# Altium schematic sheet DriverIC.SchDoc
size A4; SheetNumber: 2; SheetTotal: 4
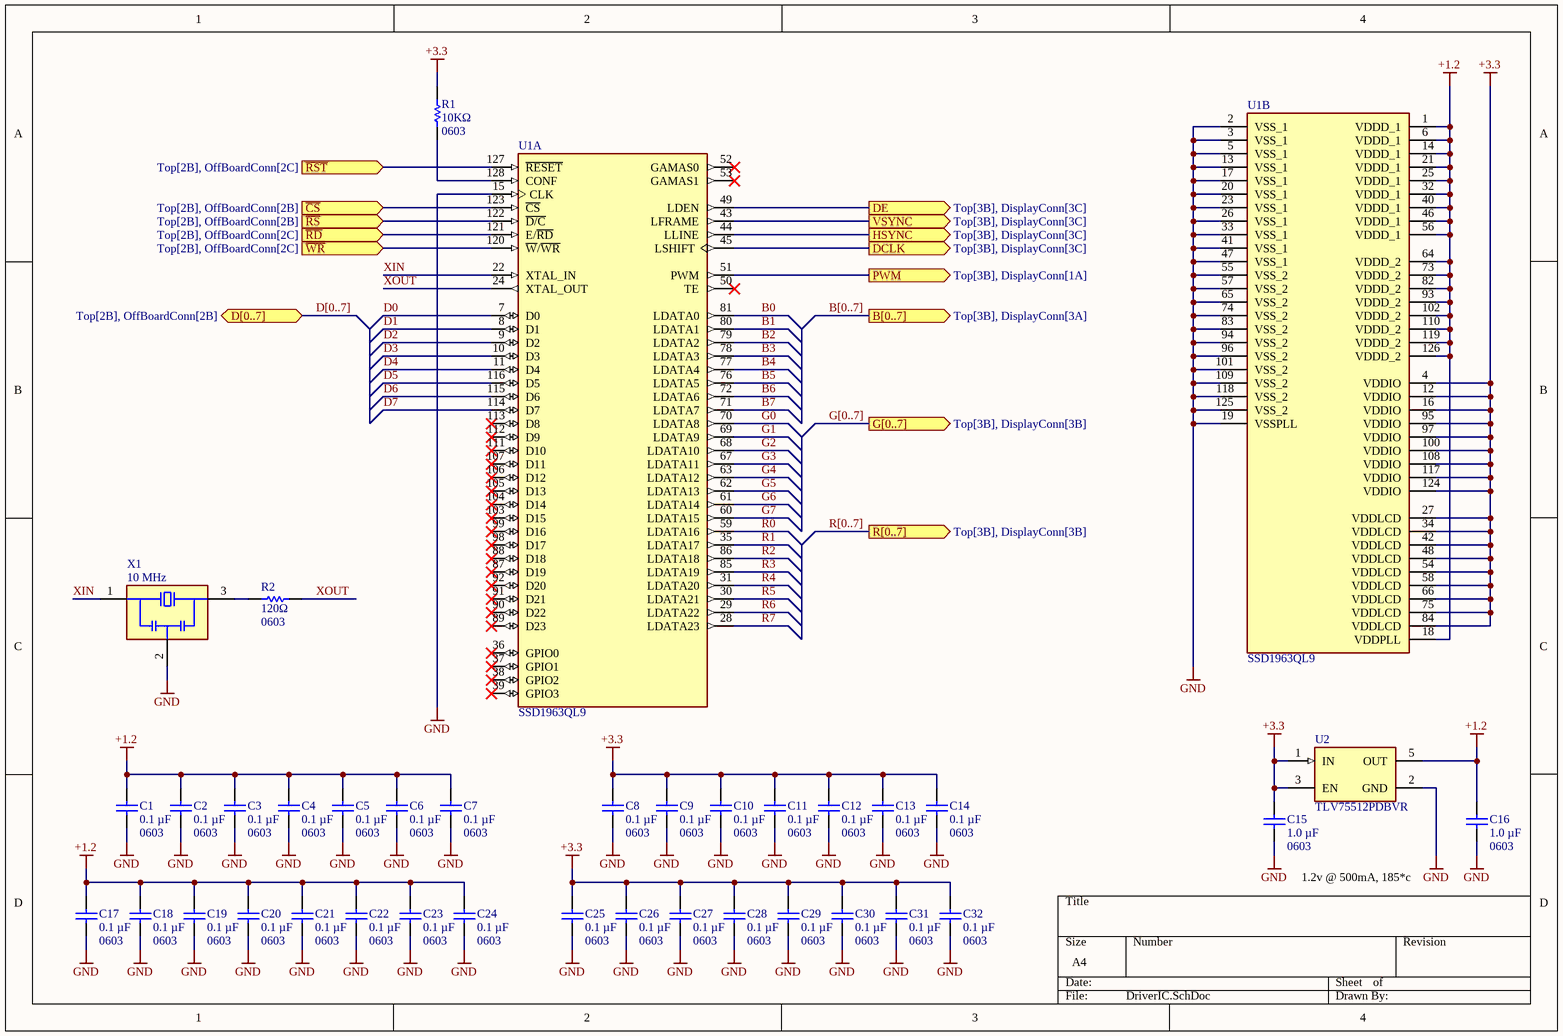
[diagram p0: DriverIC.SchDoc]

## Parts
C1  value 0.1 µF  [0603]  (hidden comment: GRM188R72A104MA35J)
C2  value 0.1 µF  [0603]  (hidden comment: GRM188R72A104MA35J)
C3  value 0.1 µF  [0603]  (hidden comment: GRM188R72A104MA35J)
C4  value 0.1 µF  [0603]  (hidden comment: GRM188R72A104MA35J)
C5  value 0.1 µF  [0603]  (hidden comment: GRM188R72A104MA35J)
C6  value 0.1 µF  [0603]  (hidden comment: GRM188R72A104MA35J)
C7  value 0.1 µF  [0603]  (hidden comment: GRM188R72A104MA35J)
C8  value 0.1 µF  [0603]  (hidden comment: GRM188R72A104MA35J)
C9  value 0.1 µF  [0603]  (hidden comment: GRM188R72A104MA35J)
C10  value 0.1 µF  [0603]  (hidden comment: GRM188R72A104MA35J)
C11  value 0.1 µF  [0603]  (hidden comment: GRM188R72A104MA35J)
C12  value 0.1 µF  [0603]  (hidden comment: GRM188R72A104MA35J)
C13  value 0.1 µF  [0603]  (hidden comment: GRM188R72A104MA35J)
C14  value 0.1 µF  [0603]  (hidden comment: GRM188R72A104MA35J)
C15  value 1.0 µF  [0603]  (hidden comment: GRM188D71H105KE01J)
C16  value 1.0 µF  [0603]  (hidden comment: GRM188D71H105KE01J)
C17  value 0.1 µF  [0603]  (hidden comment: GRM188R72A104MA35J)
C18  value 0.1 µF  [0603]  (hidden comment: GRM188R72A104MA35J)
C19  value 0.1 µF  [0603]  (hidden comment: GRM188R72A104MA35J)
C20  value 0.1 µF  [0603]  (hidden comment: GRM188R72A104MA35J)
C21  value 0.1 µF  [0603]  (hidden comment: GRM188R72A104MA35J)
C22  value 0.1 µF  [0603]  (hidden comment: GRM188R72A104MA35J)
C23  value 0.1 µF  [0603]  (hidden comment: GRM188R72A104MA35J)
C24  value 0.1 µF  [0603]  (hidden comment: GRM188R72A104MA35J)
C25  value 0.1 µF  [0603]  (hidden comment: GRM188R72A104MA35J)
C26  value 0.1 µF  [0603]  (hidden comment: GRM188R72A104MA35J)
C27  value 0.1 µF  [0603]  (hidden comment: GRM188R72A104MA35J)
C28  value 0.1 µF  [0603]  (hidden comment: GRM188R72A104MA35J)
C29  value 0.1 µF  [0603]  (hidden comment: GRM188R72A104MA35J)
C30  value 0.1 µF  [0603]  (hidden comment: GRM188R72A104MA35J)
C31  value 0.1 µF  [0603]  (hidden comment: GRM188R72A104MA35J)
C32  value 0.1 µF  [0603]  (hidden comment: GRM188R72A104MA35J)
R1  value 10KΩ  [0603]  (hidden comment: RMCF0603FG10K0)
R2  value 120Ω  [0603]  (hidden comment: RMCF0603FT120R)
U1  SSD1963QL9  [PCBComponent_1]  (parts A,B of 2)
U2  TLV75512PDBVR  [SOT-23-5]
X1  value 10 MHz  [3-SMD]  (hidden comment: CSTNE10M0G550000R0)

## Ports
B[0..7] (out, see Top[3B], DisplayConn[3A]), D[0..7] (bidir, see Top[2B], OffBoardConn[2B]), DCLK (out, see Top[3B], DisplayConn[3C]), DE (out, see Top[3B], DisplayConn[3C]), G[0..7] (out, see Top[3B], DisplayConn[3B]), HSYNC (out, see Top[3B], DisplayConn[3C]), PWM (out, see Top[3B], DisplayConn[1A]), R[0..7] (out, see Top[3B], DisplayConn[3B]), VSYNC (out, see Top[3B], DisplayConn[3C]), ~{CS} (in, see Top[2B], OffBoardConn[2B]), ~{RD} (in, see Top[2B], OffBoardConn[2C]), ~{RST} (in, see Top[2B], OffBoardConn[2C]), ~{RS} (in, see Top[2B], OffBoardConn[2B]), ~{WR} (in, see Top[2B], OffBoardConn[2C])

## Nets
+1.2: C1.2 C2.2 C3.2 C4.2 C5.2 C6.2 C7.2 C16.1 C17.2 C18.2 C19.2 C20.2 C21.2 C22.2 C23.2 C24.2 U1.1(VDDD_1) U1.6(VDDD_1) U1.14(VDDD_1) U1.18(VDDPLL) U1.21(VDDD_1) U1.25(VDDD_1) U1.32(VDDD_1) U1.40(VDDD_1) U1.46(VDDD_1) U1.56(VDDD_1) U1.64(VDDD_2) U1.73(VDDD_2) U1.82(VDDD_2) U1.93(VDDD_2) U1.102(VDDD_2) U1.110(VDDD_2) U1.119(VDDD_2) U1.126(VDDD_2) U2.5(OUT)
+3.3: C8.2 C9.2 C10.2 C11.2 C12.2 C13.2 C14.2 C15.1 C25.2 C26.2 C27.2 C28.2 C29.2 C30.2 C31.2 C32.2 R1.1 U1.4(VDDIO) U1.12(VDDIO) U1.16(VDDIO) U1.27(VDDLCD) U1.34(VDDLCD) U1.42(VDDLCD) U1.48(VDDLCD) U1.54(VDDLCD) U1.58(VDDLCD) U1.66(VDDLCD) U1.75(VDDLCD) U1.84(VDDLCD) U1.95(VDDIO) U1.97(VDDIO) U1.100(VDDIO) U1.108(VDDIO) U1.117(VDDIO) U1.124(VDDIO) U2.1(IN) U2.3(EN)
GND: C1.1 C2.1 C3.1 C4.1 C5.1 C6.1 C7.1 C8.1 C9.1 C10.1 C11.1 C12.1 C13.1 C14.1 C15.2 C16.2 C17.1 C18.1 C19.1 C20.1 C21.1 C22.1 C23.1 C24.1 C25.1 C26.1 C27.1 C28.1 C29.1 C30.1 C31.1 C32.1 U1.2(VSS_1) U1.3(VSS_1) U1.5(VSS_1) U1.13(VSS_1) U1.15(CLK) U1.17(VSS_1) U1.19(VSSPLL) U1.20(VSS_1) U1.23(VSS_1) U1.26(VSS_1) U1.33(VSS_1) U1.41(VSS_1) U1.47(VSS_1) U1.55(VSS_2) U1.57(VSS_2) U1.65(VSS_2) U1.74(VSS_2) U1.83(VSS_2) U1.94(VSS_2) U1.96(VSS_2) U1.101(VSS_2) U1.109(VSS_2) U1.118(VSS_2) U1.125(VSS_2) U2.2(GND) X1.2(GND)
B0: U1.81(LDATA0)
B1: U1.80(LDATA1)
B2: U1.79(LDATA2)
B3: U1.78(LDATA3)
B4: U1.77(LDATA4)
B5: U1.76(LDATA5)
B6: U1.72(LDATA6)
B7: U1.71(LDATA7)
~{CS}: U1.123(~{CS}) ; port ~{CS}
D0: U1.7(D0)
D1: U1.8(D1)
D2: U1.9(D2)
D3: U1.10(D3)
D4: U1.11(D4)
D5: U1.116(D5)
D6: U1.115(D6)
D7: U1.114(D7)
DCLK: U1.45(LSHIFT) ; port DCLK
DE: U1.49(LDEN) ; port DE
G0: U1.70(LDATA8)
G1: U1.69(LDATA9)
G2: U1.68(LDATA10)
G3: U1.67(LDATA11)
G4: U1.63(LDATA12)
G5: U1.62(LDATA13)
G6: U1.61(LDATA14)
G7: U1.60(LDATA15)
HSYNC: U1.44(LLINE) ; port HSYNC
PWM: U1.51(PWM) ; port PWM
R0: U1.59(LDATA16)
R1: U1.35(LDATA17)
R2: U1.86(LDATA18)
R3: U1.85(LDATA19)
R4: U1.31(LDATA20)
R5: U1.30(LDATA21)
R6: U1.29(LDATA22)
R7: U1.28(LDATA23)
~{RD}: U1.121(E/~{RD}) ; port ~{RD}
~{RS}: U1.122(~{D/C}) ; port ~{RS}
~{RST}: U1.127(~{RESET}) ; port ~{RST}
VSYNC: U1.43(LFRAME) ; port VSYNC
~{WR}: U1.120(~{W}/~{WR}) ; port ~{WR}
XIN: U1.22(XTAL_IN) X1.1(IN)
XOUT: R2.1 U1.24(XTAL_OUT)
NetR1_2: R1.2 U1.128(CONF)
NetR2_2: R2.2 X1.3(OUT)

Not connected (* = marked no-connect by the designer): U1 36(GPIO0)* 37(GPIO1)* 38(GPIO2)* 39(GPIO3)* 50(TE)* 52(GAMAS0)* 53(GAMAS1)* 87(D19)* 88(D18)* 89(D23)* 90(D22)* 91(D21)* 92(D20)* 98(D17)* 99(D16)* 103(D15)* 104(D14)* 105(D13)* 106(D12)* 107(D11)* 111(D10)* 112(D9)* 113(D8)*

## Buses and harness runs
bus B[0..7] = port B[0..7]
bus D[0..7] = port D[0..7]
bus G[0..7] = port G[0..7]
bus R[0..7] = port R[0..7]

## Notes on the sheet
- 1.2v @ 500mA, 185*c

## Library data of the parts
C1-C14 C17-C32 = GRM188R72A104MA35J: 0.1 µF ±20% 100V Ceramic Capacitor X7R 0603 (1608 Metric); Case: 0603; Tolerance: ±20%; Temperature Coefficient: X7R; Voltage: 100V
C15 C16 = GRM188D71H105KE01J: 1 µF ±10% 50V Ceramic Capacitor X7T 0603 (1608 Metric); Case: 0603; Tolerance: ±10%; Temperature Coefficient: X7T; Voltage: 50V
R1 = RMCF0603FG10K0: 10 kOhms ±1% 0.1W, 1/10W Chip Resistor 0603 (1608 Metric) Automotive AEC-Q200 Thick Film; Case: 0603; Tolerance: 1%; Power: 0.1W
R2 = RMCF0603FT120R: 120 Ohms ±1% 0.1W, 1/10W Chip Resistor 0603 (1608 Metric) Automotive AEC-Q200 Thick Film; Case: 0603; Tolerance: 1%; Power: 0.1W
U1 = SSD1963QL9: LQFP-128(14x14) LCD Drivers ROHS
U2 = TLV75512PDBVR: Linear Voltage Regulator IC Positive Fixed 1 Output 500mA SOT-23-5
X1 = CSTNE10M0G550000R0: 10 MHz Ceramic Resonator Built in Capacitor 33 pF ±0.2% 40 Ohms -40°C ~ 85°C Surface Mount